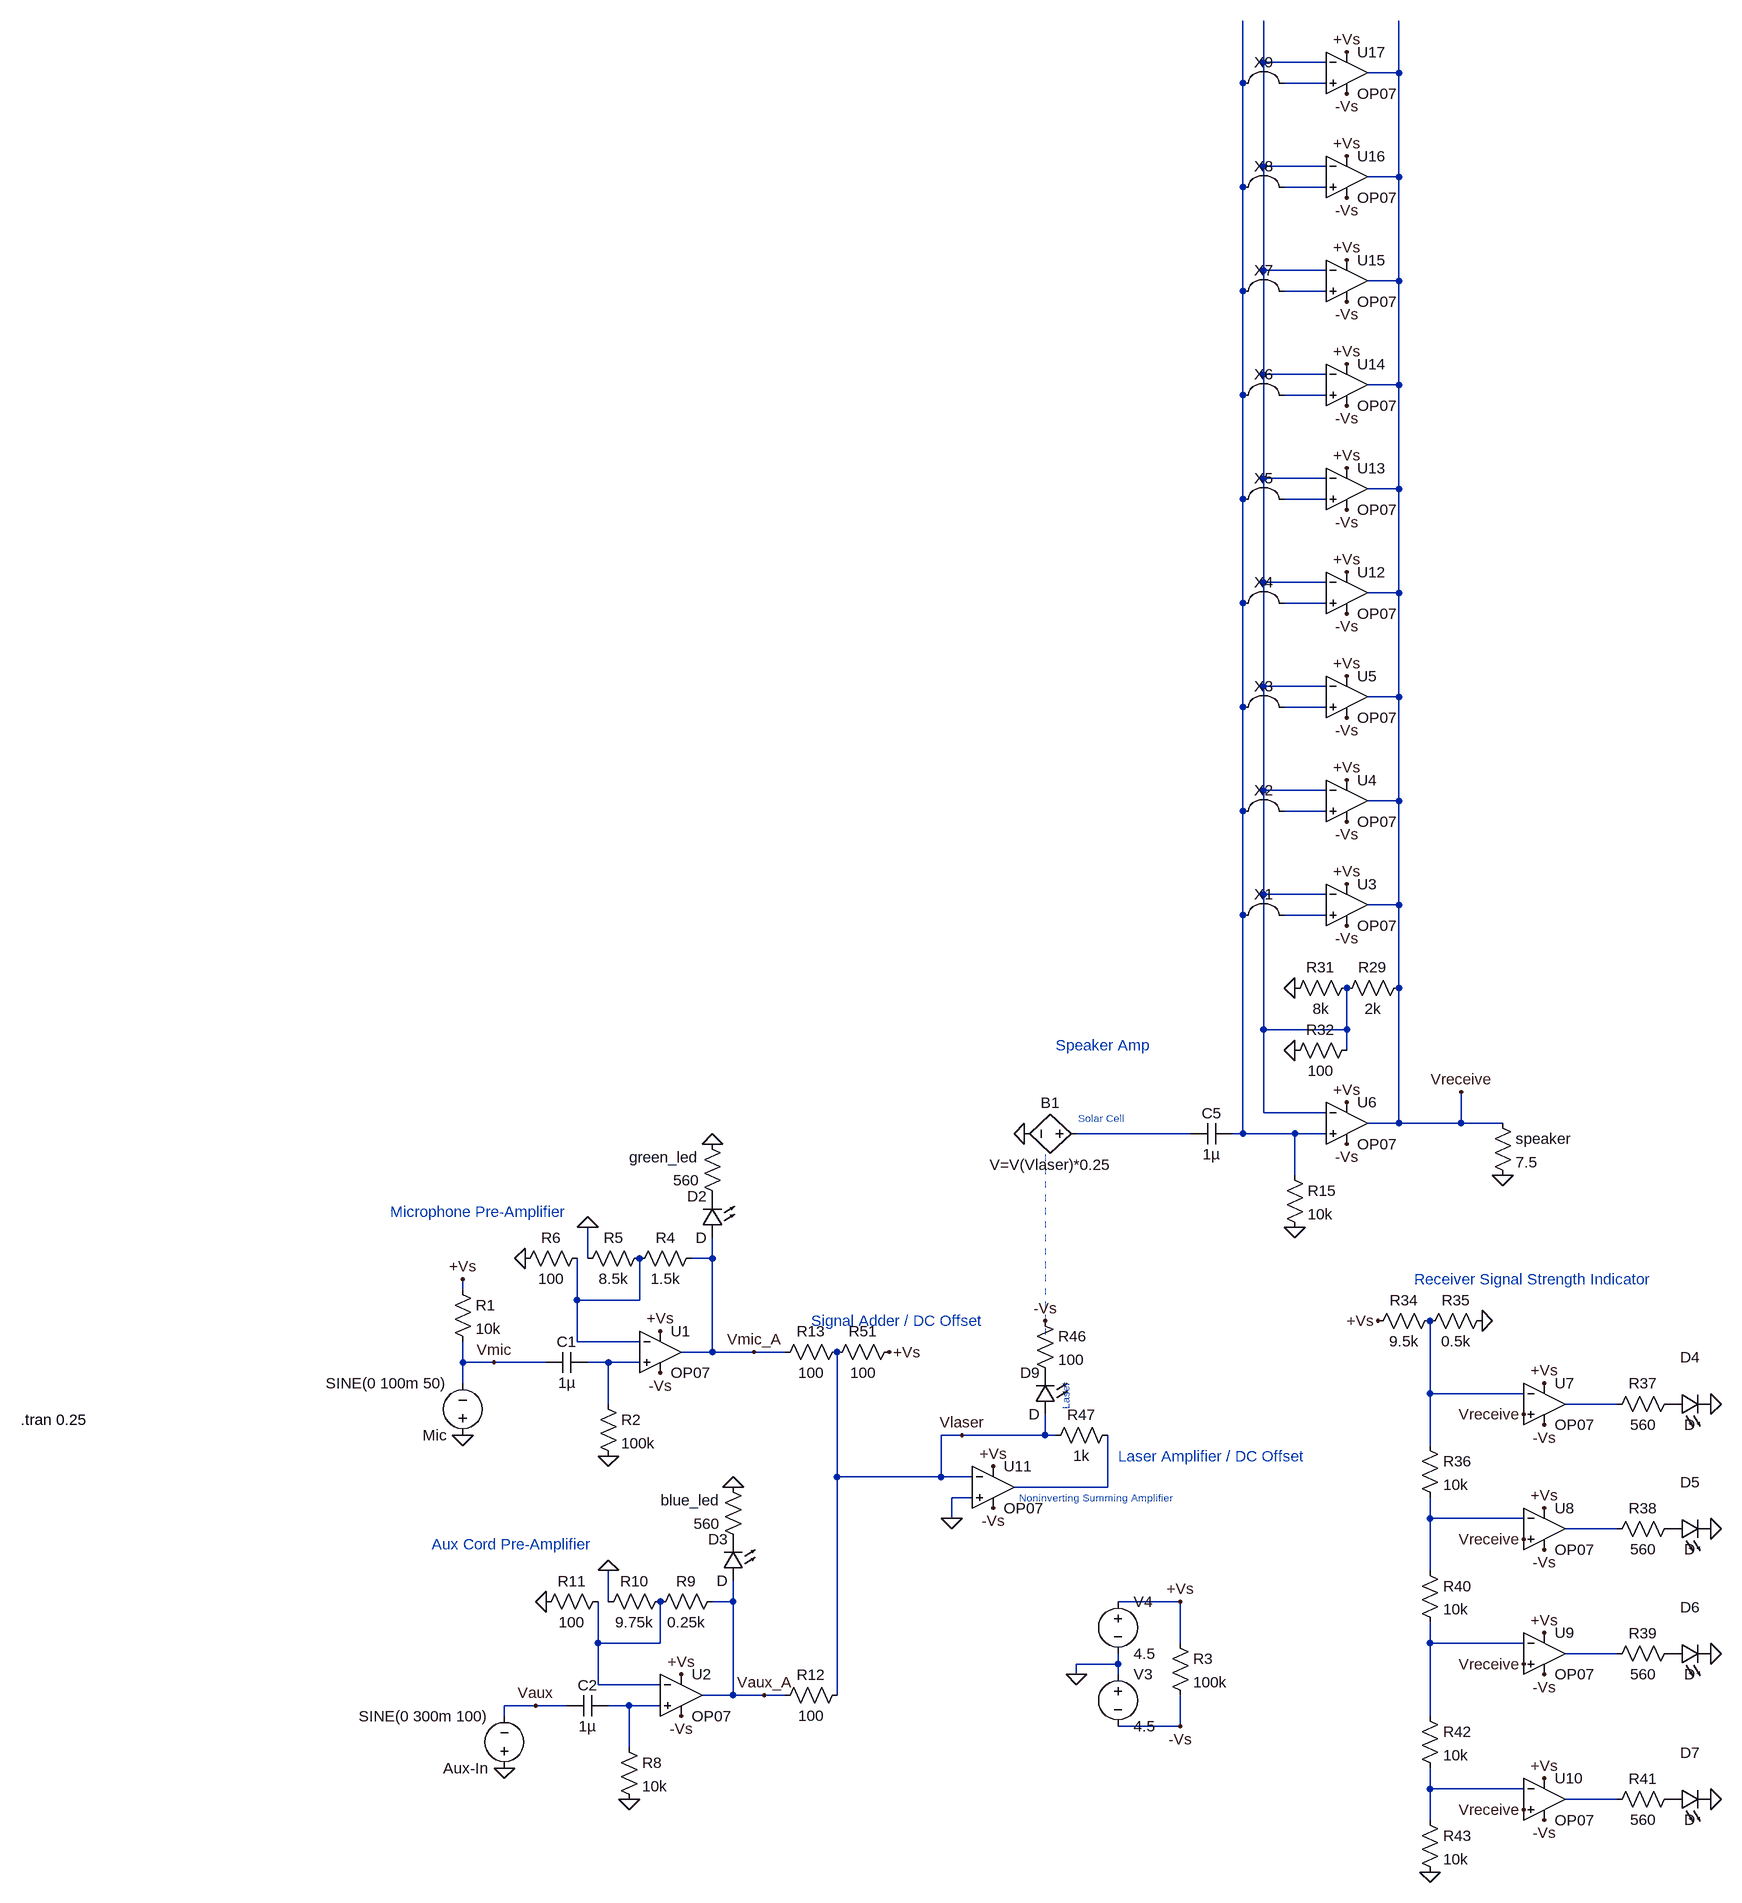
[diagram p0: schematic Laser-Based Audio Transmission System.asc]
Laser-Based Audio Transmission System.asc, the LTspice schematic file:
Version 4.1
SHEET 1 4920 1460
WIRE 1456 -1808 1456 -1872
WIRE 1552 -1808 1456 -1808
WIRE 1664 -1792 1664 -1872
WIRE 1664 -1792 1616 -1792
WIRE 1424 -1776 1424 -1872
WIRE 1552 -1776 1488 -1776
WIRE 1456 -1648 1456 -1808
WIRE 1552 -1648 1456 -1648
WIRE 1664 -1632 1664 -1792
WIRE 1664 -1632 1616 -1632
WIRE 1424 -1616 1424 -1776
WIRE 1552 -1616 1488 -1616
WIRE 1456 -1488 1456 -1648
WIRE 1552 -1488 1456 -1488
WIRE 1664 -1472 1664 -1632
WIRE 1664 -1472 1616 -1472
WIRE 1424 -1456 1424 -1616
WIRE 1552 -1456 1488 -1456
WIRE 1456 -1328 1456 -1488
WIRE 1552 -1328 1456 -1328
WIRE 1664 -1312 1664 -1472
WIRE 1664 -1312 1616 -1312
WIRE 1424 -1296 1424 -1456
WIRE 1552 -1296 1488 -1296
WIRE 1456 -1168 1456 -1328
WIRE 1552 -1168 1456 -1168
WIRE 1664 -1152 1664 -1312
WIRE 1664 -1152 1616 -1152
WIRE 1424 -1136 1424 -1296
WIRE 1552 -1136 1488 -1136
WIRE 1456 -1008 1456 -1168
WIRE 1552 -1008 1456 -1008
WIRE 1664 -992 1664 -1152
WIRE 1664 -992 1616 -992
WIRE 1424 -976 1424 -1136
WIRE 1552 -976 1488 -976
WIRE 1456 -848 1456 -1008
WIRE 1552 -848 1456 -848
WIRE 1664 -832 1664 -992
WIRE 1664 -832 1616 -832
WIRE 1424 -816 1424 -976
WIRE 1552 -816 1488 -816
WIRE 1456 -688 1456 -848
WIRE 1552 -688 1456 -688
WIRE 1664 -672 1664 -832
WIRE 1664 -672 1616 -672
WIRE 1424 -656 1424 -816
WIRE 1552 -656 1488 -656
WIRE 1456 -528 1456 -688
WIRE 1552 -528 1456 -528
WIRE 1664 -512 1664 -672
WIRE 1664 -512 1616 -512
WIRE 1424 -496 1424 -656
WIRE 1552 -496 1488 -496
WIRE 1664 -384 1664 -512
WIRE 1456 -320 1456 -528
WIRE 1584 -320 1584 -384
WIRE 1584 -320 1456 -320
WIRE 1584 -288 1584 -320
WIRE 1456 -192 1456 -320
WIRE 1552 -192 1456 -192
WIRE 1664 -176 1664 -384
WIRE 1664 -176 1616 -176
WIRE 1760 -176 1760 -224
WIRE 1760 -176 1664 -176
WIRE 1824 -176 1760 -176
WIRE 1344 -160 1168 -160
WIRE 1424 -160 1424 -496
WIRE 1424 -160 1408 -160
WIRE 1504 -160 1424 -160
WIRE 1552 -160 1504 -160
WIRE 1504 -96 1504 -160
WIRE 416 32 416 -16
WIRE 608 32 608 0
WIRE 608 32 576 32
WIRE 224 80 224 64
WIRE 400 96 400 32
WIRE 496 96 496 32
WIRE 496 96 400 96
WIRE 400 160 400 96
WIRE 496 160 400 160
WIRE 608 176 608 32
WIRE 608 176 560 176
WIRE 672 176 608 176
WIRE 720 176 672 176
WIRE 224 192 224 160
WIRE 272 192 224 192
WIRE 352 192 272 192
WIRE 448 192 416 192
WIRE 496 192 448 192
WIRE 224 224 224 192
WIRE 1712 240 1712 128
WIRE 1856 240 1712 240
WIRE 448 256 448 192
WIRE 2000 256 1920 256
WIRE 992 304 960 304
WIRE 1120 304 1120 272
WIRE 1120 304 992 304
WIRE 1136 304 1120 304
WIRE 1712 320 1712 240
WIRE 800 368 800 176
WIRE 960 368 960 304
WIRE 960 368 800 368
WIRE 1008 368 960 368
WIRE 1216 384 1216 304
WIRE 1216 384 1072 384
WIRE 1008 400 976 400
WIRE 976 432 976 400
WIRE 1712 432 1712 400
WIRE 1856 432 1712 432
WIRE 2000 448 1920 448
WIRE 1712 512 1712 432
WIRE 448 560 448 512
WIRE 640 560 640 528
WIRE 640 560 608 560
WIRE 1328 560 1232 560
WIRE 432 624 432 560
WIRE 528 624 528 560
WIRE 528 624 432 624
WIRE 1328 624 1328 560
WIRE 1712 624 1712 592
WIRE 1856 624 1712 624
WIRE 2000 640 1920 640
WIRE 1232 656 1232 640
WIRE 1232 656 1168 656
WIRE 1168 672 1168 656
WIRE 1232 672 1232 656
WIRE 432 688 432 624
WIRE 528 688 432 688
WIRE 640 704 640 560
WIRE 640 704 592 704
WIRE 688 704 640 704
WIRE 720 704 688 704
WIRE 800 704 800 368
WIRE 336 720 288 720
WIRE 384 720 336 720
WIRE 480 720 448 720
WIRE 528 720 480 720
WIRE 288 736 288 720
WIRE 1712 736 1712 624
WIRE 1328 752 1328 704
WIRE 1328 752 1232 752
WIRE 480 784 480 720
WIRE 1712 848 1712 816
WIRE 1856 848 1712 848
WIRE 2000 864 1920 864
WIRE 1712 896 1712 848
FLAG 224 304 0
FLAG 448 336 0
FLAG 1328 560 +Vs
FLAG 1168 672 0
FLAG 1328 752 -Vs
FLAG 528 144 +Vs
FLAG 528 208 -Vs
FLAG 320 32 0
FLAG 416 -16 0
FLAG 224 64 +Vs
FLAG 288 816 0
FLAG 480 864 0
FLAG 560 672 +Vs
FLAG 560 736 -Vs
FLAG 352 560 0
FLAG 448 512 0
FLAG 1088 -160 0
FLAG 1504 -16 0
FLAG 1584 -208 +Vs
FLAG 1584 -144 -Vs
FLAG 1504 -288 0
FLAG 1504 -384 0
FLAG 1824 -96 0
FLAG 608 -144 0
FLAG 640 384 0
FLAG 1632 128 +Vs
FLAG 1760 -224 Vreceive
FLAG 1856 272 Vreceive
FLAG 1888 224 +Vs
FLAG 1888 288 -Vs
FLAG 2144 256 0
FLAG 1856 464 Vreceive
FLAG 1888 416 +Vs
FLAG 1888 480 -Vs
FLAG 2144 448 0
FLAG 1856 656 Vreceive
FLAG 1888 608 +Vs
FLAG 1888 672 -Vs
FLAG 2144 640 0
FLAG 1856 880 Vreceive
FLAG 1888 832 +Vs
FLAG 1888 896 -Vs
FLAG 2144 864 0
FLAG 1712 976 0
FLAG 992 304 Vlaser
FLAG 976 432 0
FLAG 1040 416 -Vs
FLAG 1040 352 +Vs
FLAG 880 176 +Vs
FLAG 1120 128 -Vs
FLAG 1792 128 0
FLAG 272 192 Vmic
FLAG 672 176 Vmic_A
FLAG 336 720 Vaux
FLAG 688 704 Vaux_A
FLAG 1584 -544 +Vs
FLAG 1584 -480 -Vs
FLAG 1584 -704 +Vs
FLAG 1584 -640 -Vs
FLAG 1584 -864 +Vs
FLAG 1584 -800 -Vs
FLAG 1584 -1024 +Vs
FLAG 1584 -960 -Vs
FLAG 1584 -1184 +Vs
FLAG 1584 -1120 -Vs
FLAG 1584 -1344 +Vs
FLAG 1584 -1280 -Vs
FLAG 1584 -1504 +Vs
FLAG 1584 -1440 -Vs
FLAG 1584 -1664 +Vs
FLAG 1584 -1600 -Vs
FLAG 1584 -1824 +Vs
FLAG 1584 -1760 -Vs
SYMBOL res 208 64 R0
SYMATTR InstName R1
SYMATTR Value 10k
SYMBOL cap 416 176 R90
WINDOW 0 0 32 VBottom 2
WINDOW 3 32 32 VTop 2
SYMATTR InstName C1
SYMATTR Value 1µ
SYMBOL OpAmps\\OP07 528 112 R0
SYMATTR InstName U1
SYMBOL res 432 240 R0
SYMATTR InstName R2
SYMATTR Value 100k
SYMBOL voltage 1232 656 R0
WINDOW 123 0 0 Left 0
WINDOW 39 0 0 Left 0
SYMATTR InstName V3
SYMATTR Value 4.5
SYMBOL voltage 1232 544 R0
WINDOW 123 0 0 Left 0
WINDOW 39 0 0 Left 0
SYMATTR InstName V4
SYMATTR Value 4.5
SYMBOL res 1312 608 R0
SYMATTR InstName R3
SYMATTR Value 100k
SYMBOL res 592 16 R90
WINDOW 0 0 56 VBottom 2
WINDOW 3 32 56 VTop 2
SYMATTR InstName R4
SYMATTR Value 1.5k
SYMBOL res 512 16 R90
WINDOW 0 0 56 VBottom 2
WINDOW 3 32 56 VTop 2
SYMATTR InstName R5
SYMATTR Value 8.5k
SYMBOL res 416 16 R90
WINDOW 0 0 56 VBottom 2
WINDOW 3 32 56 VTop 2
SYMATTR InstName R6
SYMATTR Value 100
SYMBOL voltage 224 320 R180
WINDOW 123 0 0 Left 0
WINDOW 39 0 0 Left 0
SYMATTR InstName Mic
SYMATTR Value SINE(0 100m 50)
SYMBOL cap 448 704 R90
WINDOW 0 0 32 VBottom 2
WINDOW 3 32 32 VTop 2
SYMATTR InstName C2
SYMATTR Value 1µ
SYMBOL OpAmps\\OP07 560 640 R0
SYMATTR InstName U2
SYMBOL res 464 768 R0
SYMATTR InstName R8
SYMATTR Value 10k
SYMBOL res 624 544 R90
WINDOW 0 0 56 VBottom 2
WINDOW 3 32 56 VTop 2
SYMATTR InstName R9
SYMATTR Value 0.25k
SYMBOL res 544 544 R90
WINDOW 0 0 56 VBottom 2
WINDOW 3 32 56 VTop 2
SYMATTR InstName R10
SYMATTR Value 9.75k
SYMBOL res 448 544 R90
WINDOW 0 0 56 VBottom 2
WINDOW 3 32 56 VTop 2
SYMATTR InstName R11
SYMATTR Value 100
SYMBOL voltage 288 832 R180
WINDOW 123 0 0 Left 0
WINDOW 39 0 0 Left 0
SYMATTR InstName Aux-In
SYMATTR Value SINE(0 300m 100)
SYMBOL res 816 688 R90
WINDOW 0 0 56 VBottom 2
WINDOW 3 32 56 VTop 2
SYMATTR InstName R12
SYMATTR Value 100
SYMBOL res 816 160 R90
WINDOW 0 0 56 VBottom 2
WINDOW 3 32 56 VTop 2
SYMATTR InstName R13
SYMATTR Value 100
SYMBOL bv 1184 -160 R90
WINDOW 0 -32 56 VBottom 2
WINDOW 3 32 56 VTop 2
SYMATTR InstName B1
SYMATTR Value V=V(Vlaser)*0.25
SYMBOL cap 1408 -176 R90
WINDOW 0 0 32 VBottom 2
WINDOW 3 32 32 VTop 2
SYMATTR InstName C5
SYMATTR Value 1µ
SYMBOL OpAmps\\OP07 1584 -240 R0
SYMATTR InstName U6
SYMBOL res 1488 -112 R0
SYMATTR InstName R15
SYMATTR Value 10k
SYMBOL res 1680 -400 R90
WINDOW 0 0 56 VBottom 2
WINDOW 3 32 56 VTop 2
SYMATTR InstName R29
SYMATTR Value 2k
SYMBOL res 1600 -400 R90
WINDOW 0 0 56 VBottom 2
WINDOW 3 32 56 VTop 2
SYMATTR InstName R31
SYMATTR Value 8k
SYMBOL res 1488 -272 R270
WINDOW 0 32 56 VTop 2
WINDOW 3 0 56 VBottom 2
SYMATTR InstName R32
SYMATTR Value 100
SYMBOL res 1808 -192 R0
SYMATTR InstName speaker
SYMATTR Value 7.5
SYMBOL LED 624 0 R180
WINDOW 0 24 64 Left 2
WINDOW 3 24 0 Left 2
SYMATTR InstName D2
SYMBOL res 624 -48 R180
WINDOW 0 36 76 Left 2
WINDOW 3 36 40 Left 2
SYMATTR InstName green_led
SYMATTR Value 560
SYMBOL LED 656 528 R180
WINDOW 0 24 64 Left 2
WINDOW 3 24 0 Left 2
SYMATTR InstName D3
SYMBOL res 656 480 R180
WINDOW 0 36 76 Left 2
WINDOW 3 36 40 Left 2
SYMATTR InstName blue_led
SYMATTR Value 560
SYMBOL OpAmps\\OP07 1888 192 R0
SYMATTR InstName U7
SYMBOL res 1728 112 R90
WINDOW 0 0 56 VBottom 2
WINDOW 3 32 56 VTop 2
SYMATTR InstName R34
SYMATTR Value 9.5k
SYMBOL res 1808 112 R90
WINDOW 0 0 56 VBottom 2
WINDOW 3 32 56 VTop 2
SYMATTR InstName R35
SYMATTR Value 0.5k
SYMBOL res 1696 304 R0
SYMATTR InstName R36
SYMATTR Value 10k
SYMBOL res 2096 240 R90
WINDOW 0 0 56 VBottom 2
WINDOW 3 32 56 VTop 2
SYMATTR InstName R37
SYMATTR Value 560
SYMBOL LED 2080 272 R270
WINDOW 0 72 32 VTop 2
WINDOW 3 0 32 VBottom 2
SYMATTR InstName D4
SYMBOL OpAmps\\OP07 1888 384 R0
SYMATTR InstName U8
SYMBOL res 2096 432 R90
WINDOW 0 0 56 VBottom 2
WINDOW 3 32 56 VTop 2
SYMATTR InstName R38
SYMATTR Value 560
SYMBOL LED 2080 464 R270
WINDOW 0 72 32 VTop 2
WINDOW 3 0 32 VBottom 2
SYMATTR InstName D5
SYMBOL OpAmps\\OP07 1888 576 R0
SYMATTR InstName U9
SYMBOL res 2096 624 R90
WINDOW 0 0 56 VBottom 2
WINDOW 3 32 56 VTop 2
SYMATTR InstName R39
SYMATTR Value 560
SYMBOL LED 2080 656 R270
WINDOW 0 72 32 VTop 2
WINDOW 3 0 32 VBottom 2
SYMATTR InstName D6
SYMBOL res 1696 496 R0
SYMATTR InstName R40
SYMATTR Value 10k
SYMBOL OpAmps\\OP07 1888 800 R0
SYMATTR InstName U10
SYMBOL res 2096 848 R90
WINDOW 0 0 56 VBottom 2
WINDOW 3 32 56 VTop 2
SYMATTR InstName R41
SYMATTR Value 560
SYMBOL LED 2080 880 R270
WINDOW 0 72 32 VTop 2
WINDOW 3 0 32 VBottom 2
SYMATTR InstName D7
SYMBOL res 1696 720 R0
SYMATTR InstName R42
SYMATTR Value 10k
SYMBOL res 1696 880 R0
SYMATTR InstName R43
SYMATTR Value 10k
SYMBOL LED 1136 272 R180
WINDOW 0 24 64 Left 2
WINDOW 3 24 0 Left 2
SYMATTR InstName D9
SYMBOL res 1104 112 R0
SYMATTR InstName R46
SYMATTR Value 100
SYMBOL OpAmps\\OP07 1040 320 R0
SYMATTR InstName U11
SYMBOL res 1232 288 R90
WINDOW 0 0 56 VBottom 2
WINDOW 3 32 56 VTop 2
SYMATTR InstName R47
SYMATTR Value 1k
SYMBOL res 784 192 R270
WINDOW 0 32 56 VTop 2
WINDOW 3 0 56 VBottom 2
SYMATTR InstName R51
SYMATTR Value 100
SYMBOL OpAmps\\OP07 1584 -576 R0
SYMATTR InstName U3
SYMBOL Misc\\jumper 1456 -560 R0
SYMATTR InstName X1
SYMBOL OpAmps\\OP07 1584 -736 R0
SYMATTR InstName U4
SYMBOL Misc\\jumper 1456 -720 R0
SYMATTR InstName X2
SYMBOL OpAmps\\OP07 1584 -896 R0
SYMATTR InstName U5
SYMBOL Misc\\jumper 1456 -880 R0
SYMATTR InstName X3
SYMBOL OpAmps\\OP07 1584 -1056 R0
SYMATTR InstName U12
SYMBOL Misc\\jumper 1456 -1040 R0
SYMATTR InstName X4
SYMBOL OpAmps\\OP07 1584 -1216 R0
SYMATTR InstName U13
SYMBOL Misc\\jumper 1456 -1200 R0
SYMATTR InstName X5
SYMBOL OpAmps\\OP07 1584 -1376 R0
SYMATTR InstName U14
SYMBOL Misc\\jumper 1456 -1360 R0
SYMATTR InstName X6
SYMBOL OpAmps\\OP07 1584 -1536 R0
SYMATTR InstName U15
SYMBOL Misc\\jumper 1456 -1520 R0
SYMATTR InstName X7
SYMBOL OpAmps\\OP07 1584 -1696 R0
SYMATTR InstName U16
SYMBOL Misc\\jumper 1456 -1680 R0
SYMATTR InstName X8
SYMBOL OpAmps\\OP07 1584 -1856 R0
SYMATTR InstName U17
SYMBOL Misc\\jumper 1456 -1840 R0
SYMATTR InstName X9
TEXT -456 280 Left 2 !.tran 0.25
TEXT 112 -40 Left 2 ;Microphone Pre-Amplifier
TEXT 176 472 Left 2 ;Aux Cord Pre-Amplifier
TEXT 760 128 Left 2 ;Signal Adder / DC Offset
TEXT 1232 336 Left 2 ;Laser Amplifier / DC Offset
TEXT 1152 224 VRight 1 ;Laser
TEXT 1240 -184 Right 1 ;Solar Cell
TEXT 1136 -296 Left 2 ;Speaker Amp
TEXT 1688 64 Left 2 ;Receiver Signal Strength Indicator
TEXT 1080 400 Left 1 ;Noninverting Summing Amplifier
LINE Normal 1120 -128 1120 160 2

The netlist it stands for:
* Laser-Based Audio Transmission System.asc
R1 +Vs Vmic 10k
C1 N005 Vmic 1µ
X§U1 N005 N004 +Vs -Vs Vmic_A LT1001  ; OP07, pins In+ In- V+ V- OUT
R2 N005 0 100k
V3 0 -Vs 4.5
V4 +Vs 0 4.5
R3 +Vs -Vs 100k
R4 Vmic_A N004 1.5k
R5 N004 0 8.5k
R6 N004 0 100
V§Mic 0 Vmic SINE(0 100m 50)
C2 N014 Vaux 1µ
X§U2 N014 N011 +Vs -Vs Vaux_A LT1001  ; OP07, pins In+ In- V+ V- OUT
R8 N014 0 10k
R9 Vaux_A N011 0.25k
R10 N011 0 9.75k
R11 N011 0 100
V§Aux-In 0 Vaux SINE(0 300m 100)
R12 Vlaser Vaux_A 100
R13 Vlaser Vmic_A 100
B1 N003 0 V=V(Vlaser)*0.25
C5 N002 N003 1µ
X§U6 N002 N001 +Vs -Vs Vreceive LT1001  ; OP07, pins In+ In- V+ V- OUT
R15 N002 0 10k
R29 Vreceive N001 2k
R31 N001 0 8k
R32 0 N001 100
R§speaker Vreceive 0 7.5
D2 Vmic_A P001 D
R§green_led P001 0 560
D3 Vaux_A P002 D
R§blue_led P002 0 560
X§U7 Vreceive N006 +Vs -Vs N007 LT1001  ; OP07, pins In+ In- V+ V- OUT
R34 N006 +Vs 9.5k
R35 0 N006 0.5k
R36 N006 N009 10k
R37 P003 N007 560
D4 P003 0 D
X§U8 Vreceive N009 +Vs -Vs N010 LT1001  ; OP07, pins In+ In- V+ V- OUT
R38 P004 N010 560
D5 P004 0 D
X§U9 Vreceive N012 +Vs -Vs N013 LT1001  ; OP07, pins In+ In- V+ V- OUT
R39 P005 N013 560
D6 P005 0 D
R40 N009 N012 10k
X§U10 Vreceive N015 +Vs -Vs N016 LT1001  ; OP07, pins In+ In- V+ V- OUT
R41 P006 N016 560
D7 P006 0 D
R42 N012 N015 10k
R43 N015 0 10k
D9 Vlaser P007 D
R46 -Vs P007 100
X§U11 0 Vlaser +Vs -Vs N008 LT1001  ; OP07, pins In+ In- V+ V- OUT
R47 N008 Vlaser 1k
R51 Vlaser +Vs 100
X§U3 N002 N001 +Vs -Vs Vreceive LT1001  ; OP07, pins In+ In- V+ V- OUT
X§U4 N002 N001 +Vs -Vs Vreceive LT1001  ; OP07, pins In+ In- V+ V- OUT
X§U5 N002 N001 +Vs -Vs Vreceive LT1001  ; OP07, pins In+ In- V+ V- OUT
X§U12 N002 N001 +Vs -Vs Vreceive LT1001  ; OP07, pins In+ In- V+ V- OUT
X§U13 N002 N001 +Vs -Vs Vreceive LT1001  ; OP07, pins In+ In- V+ V- OUT
X§U14 N002 N001 +Vs -Vs Vreceive LT1001  ; OP07, pins In+ In- V+ V- OUT
X§U15 N002 N001 +Vs -Vs Vreceive LT1001  ; OP07, pins In+ In- V+ V- OUT
X§U16 N002 N001 +Vs -Vs Vreceive LT1001  ; OP07, pins In+ In- V+ V- OUT
X§U17 N002 N001 +Vs -Vs Vreceive LT1001  ; OP07, pins In+ In- V+ V- OUT
.model D D
.lib standard.dio
.tran 0.25
* Microphone Pre-Amplifier
* Aux Cord Pre-Amplifier
* Signal Adder / DC Offset
* Laser Amplifier / DC Offset
* Laser
* Solar Cell
* Speaker Amp
* Receiver Signal Strength Indicator
* Noninverting Summing Amplifier
.lib LTC.lib
.backanno
.end